# Altium schematic sheet SCH.SchDoc
size A4
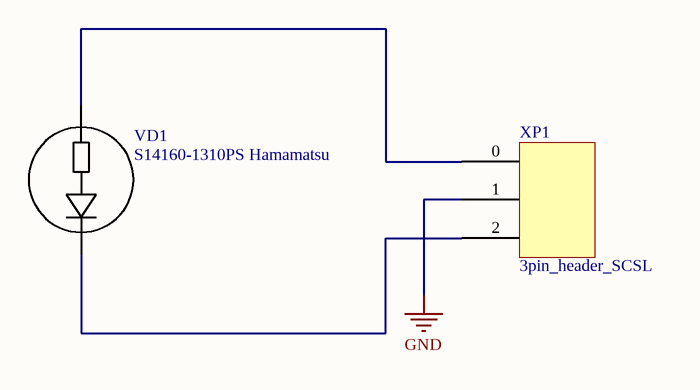
[diagram p0: SCH.SchDoc]

## Parts
VD1  S14160-1310PS Hamamatsu  [S14160-1310PS]
XP1  3pin_header_SCSL  [3pin_header - SCSL]

## Nets
GND: XP1.1
NetVD1_2: VD1.2(C) XP1.2
NetVD1_3: VD1.3(A) XP1.0

## Library data of the parts
VD1 = S14160-1310PS: Name: S14160-1310PS; Manufacturer: Hamamatsu